# EasyEDA Pro project 树莓派拓展.eprj

# Schematic Schematic1
Create Date: 2024-01-30; Page Name: P1; Project Name: 树莓派拓展; Schematic Name: Schematic1; Update Date: 2024-01-30; Company: 嘉立创EDA; Page Size: A4; Version: V1.0
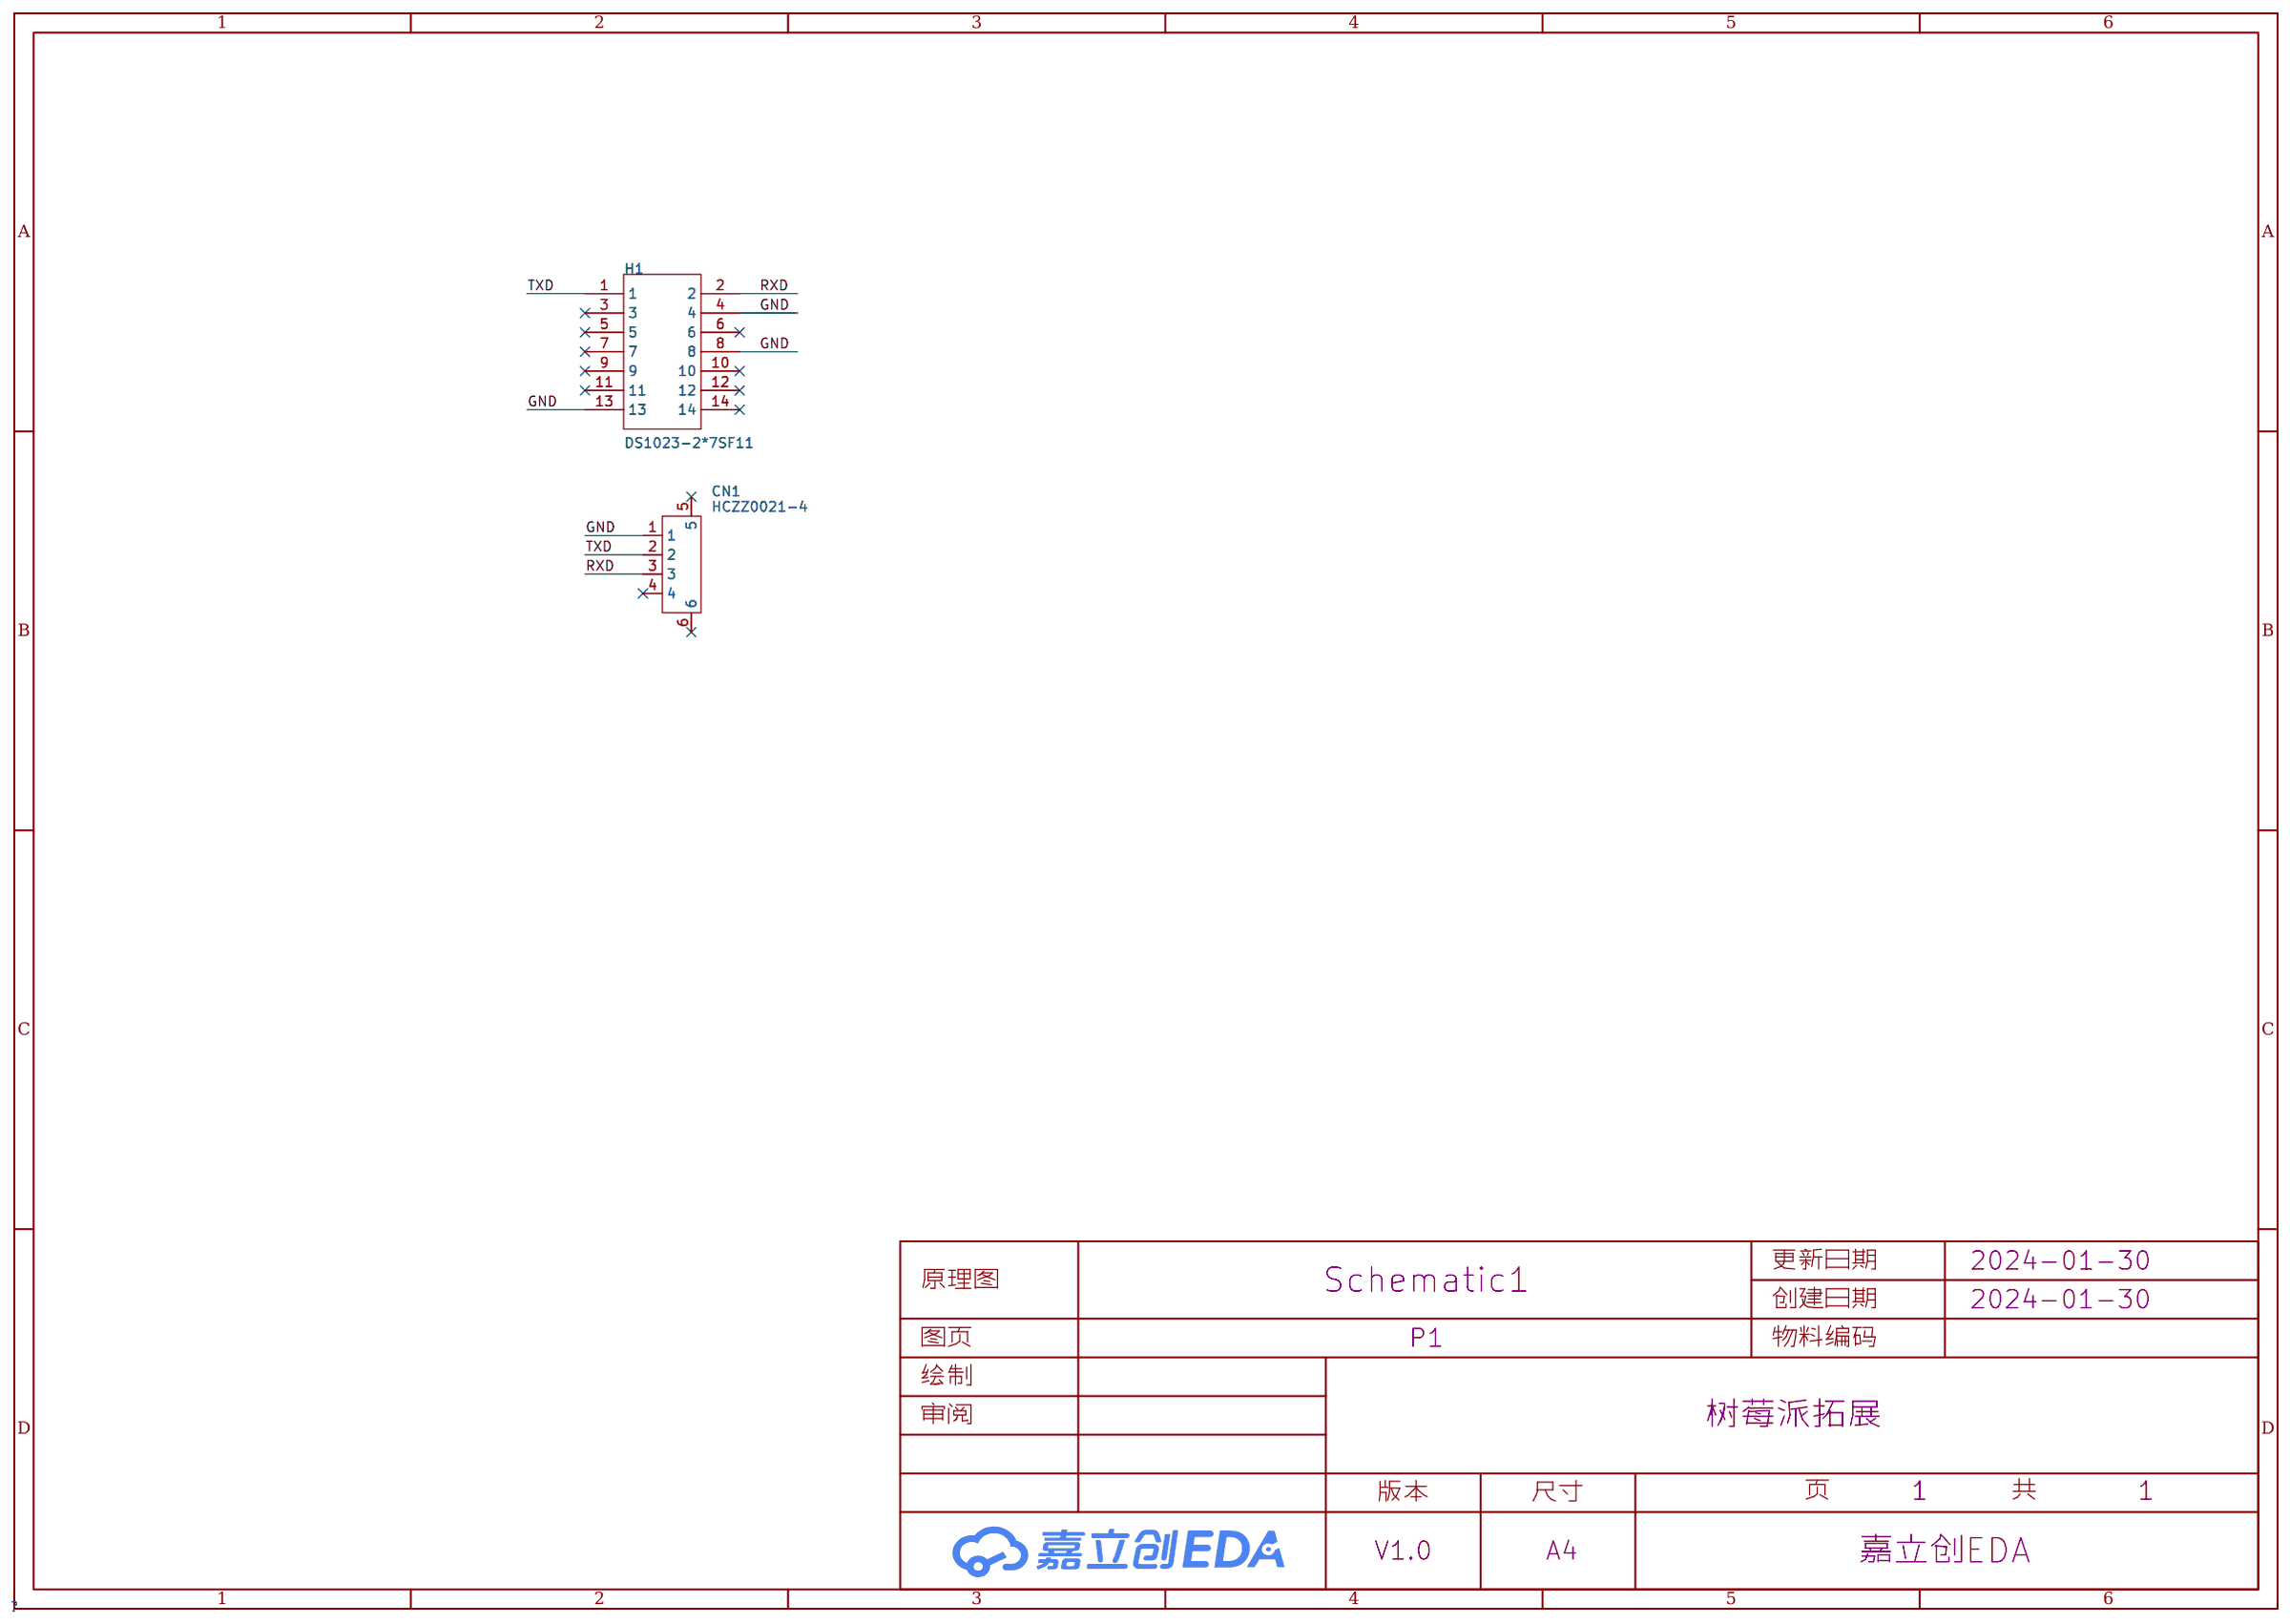
[diagram p0: schematic sheet]

## Parts
CN1  HCZZ0021-4  [CONN-SMD_HCZZ0021-4]
H1  DS1023-2*7SF11  [HDR-TH_14P-P2.54-V-F-R2-C7-S2.54-1]

## Library data of the parts
CN1 = HCZZ0021-4: 插针结构:1x4P;间距:2.54mm;安装方式:卧贴;参考系列:XH;总PIN数:4P;排数:1;每排PIN数:4;额定电流:3A;触头材质:黄铜;触头镀层:镀锡;工作温度范围:-25℃~+85℃;; LCSC Part Name: 1x4P 间距:2.54mm 卧贴 系列:XH 米色; Supplier Part: C7433709; Manufacturer: HC(虹成电子); Supplier Footprint: SMD,P=2.54mm,卧贴; JLCPCB Part Class: 扩展库; Datasheet: https://atta.szlcsc.com/upload/public/pdf/source/20230707/C131C7122CD022F605D91523F6F1F87F.pdf; Supplier: LCSC; Pins Structure: 1x4P; Pitch: 2.54mm; Mounting Style: 卧贴; Reference Series: XH; Number of Pins: 4P; Number of Rows: 1; Number of PINs Per Row: 4; Current Rating (Max): 3A; Contact Material: 黄铜; Contact Plating: 镀锡; Operating Temperature Range: -25℃~+85℃
H1 = DS1023-2*7SF11: 插孔结构:2x7P;间距:2.54mm;行距:2.54mm;安装类型:直插;排数:双排;总孔位数:14P;塑高:-;触头材质:-;触头镀层:-;; LCSC Part Name: 间距:2.54mm 2x7P 直插; Supplier Part: C113344; Manufacturer: CONNFLY; Supplier Footprint: 插件,P=2.54mm; JLCPCB Part Class: 扩展库; Datasheet: https://atta.szlcsc.com/upload/public/pdf/source/20170925/C132132_1506321659018990428.pdf; Supplier: LCSC; Holes Structure: 2x7P; Pitch: 2.54mm; Row Spacing: 2.54mm; Mounting Type: 直插; Number of Rows: 双排; Number of Holes: 14P

## Nets
GND: CN1.1 H1.4 H1.8 H1.13
RXD: CN1.3 H1.2
TXD: CN1.2 H1.1

Not connected (* = marked no-connect by the designer): CN1 4* 5* 6*; H1 3* 5* 6* 7* 9* 10* 11* 12* 14*

# Board PCB1
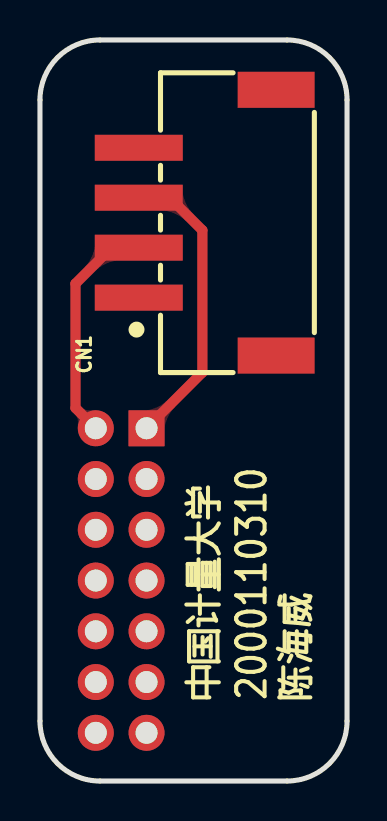
[diagram p1: board, top side]
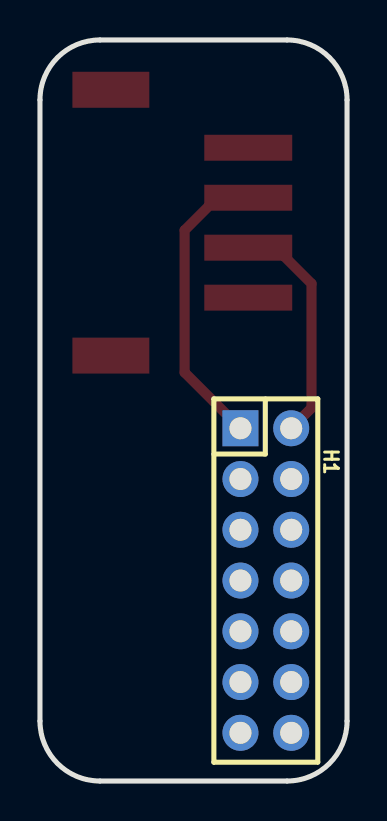
[diagram p2: board, bottom side, seen from below]

Outline 15.37 x 37.08 mm; copper layers: Top Layer, Bottom Layer. Coordinates in mm from the lower left corner of the outline.
Outline path: 0,34.08 0,3 arc(0.88,0.88) 3,0 12.37,0 arc(14.49,0.88) 15.37,3 15.37,34.08 arc(14.49,36.21) 12.37,37.08 3,37.08 arc(0.88,36.21) 0,34.08
Stack: Top Layer 0.035mm / Dielectric1 1.51mm FR4 er 4.5 / Bottom Layer 0.035mm

## Design rules (mm)
template: JLCPCB Capability(Two Layers Board)
spacing copperThickness1oz (default): track to track 0.102, other pairs 0.152 to 0.3
spacing copperThickness2oz: track to track 0.203, other pairs 0.152 to 0.3
track width copperThickness1oz (default): min 0.127, default 0.254, max 2.54
track width copperThickness2oz: min 0.203, default 0.254, max 2.54
differential pair differentialPair (default): width min 0.127, default 0.254, max 2.54; gap min 0.152, default 0.152
via viaSize (default): diameter min 0.5, default 0.61, max 10; hole min 0.3, default 0.305, max 6.3

## Placement (name value [footprint] x y rotation side)
CN1  HCZZ0021-4  [CONN-SMD_HCZZ0021-4]  8.38 27.94 90 top
H1  DS1023-2*7SF11  [HDR-TH_14P-P2.54-V-F-R2-C7-S2.54-1]  4.06 10.03 270 bottom

## Footprints (pads in the part's own frame, mm; a bottom-side part is the same pattern mirrored in y, then rotated)
CONN-SMD_HCZZ0021-4
  rect 1.3x4.4 smd: 1(-3.75,3.438) 2(-1.25,3.438) 3(1.25,3.438) 4(3.75,3.438)
  rect 1.8x3.85 smd: 5(-6.65,-3.438) 6(6.65,-3.438)
HDR-TH_14P-P2.54-V-F-R2-C7-S2.54-1
  rect 1.8x1.8 hole 1.1: 1(-7.62,-1.27)
  round 1.8 hole 1.1: 2(-7.62,1.27) 3(-5.08,-1.27) 4(-5.08,1.27) 5(-2.54,-1.27) 6(-2.54,1.27) 7(0,-1.27) 8(0,1.27) 9(2.54,-1.27) 10(2.54,1.27) 11(5.08,-1.27) 12(5.08,1.27) 13(7.62,-1.27) 14(7.62,1.27)

## Nets
GND: CN1.1 H1.3 H1.7 H1.14
RXD: CN1.3 H1.1
TXD: CN1.2 H1.2

Pads without a net: CN1 4 5 6; H1 4 5 6 8 9 10 11 12 13

## Routing (per net, layer and track width the routed paths; a pad name or vN(x,y) marks a point on that pad's centre or on a via; arc(x,y) is an arc through that point)
RXD: length 14.9
  Top Layer w0.508: CN1.3 5.05,29.08 6.6,29.08 8.13,27.56 8.13,20.45 H1.1
TXD: length 11.6
  Top Layer w0.508: H1.2 1.78,18.67 1.78,24.89 3.56,26.67 4.92,26.67 CN1.2

## Copper pours and planes (outline as drawn; the poured copper is in the pictures)
GND on Top Layer: 0,37.21 15.49,37.21 15.49,0 0,0

Small or netless copper shapes (teardrops, artwork), in the pictures only: 4 on Top Layer

## Text on the board
Top Silkscreen Layer: 中国计量大学 / 2000110310 / 陈海威
